# Altium project Genesys Hat.PrjPcb
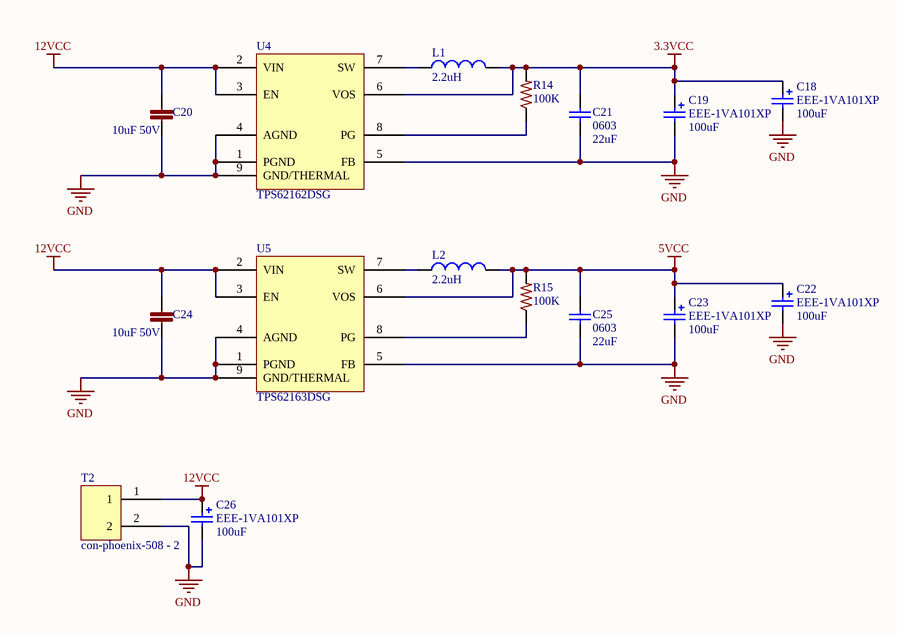
[diagram p0: Power.SchDoc]
6 sheets, 160 parts. Net scope: hierarchical (ports join the sheet entries above them; power ports are global).
Sheets:
  Power.SchDoc
  GenesysHat - System.SchDoc
    U_M = M.SchDoc
    U_MOSFETs = MOSFETs.SchDoc
    U_Sensors and IO = Sensors and IO.SchDoc
    U_MCU = MCU.SchDoc
    U_M = M.SchDoc

## Sheet Power.SchDoc
size A

### Parts
C18  EEE-1VA101XP  value 100uF  [EEE-1VA101XP]
C19  EEE-1VA101XP  value 100uF  [EEE-1VA101XP]
C20  10uF 50V  [C1206]
C21  0603  value 22uF  [C0805]
C22  EEE-1VA101XP  value 100uF  [EEE-1VA101XP]
C23  EEE-1VA101XP  value 100uF  [EEE-1VA101XP]
C24  10uF 50V  [C1206]
C25  0603  value 22uF  [C0805]
C26  EEE-1VA101XP  value 100uF  [EEE-1VA101XP]
L1  value 2.2uH  [VLS252012T-2R2M1R3]  (hidden comment: VLS252012T-2R2M1R3)
L2  value 2.2uH  [VLS252012T-2R2M1R3]  (hidden comment: VLS252012T-2R2M1R3)
R14  100K  [R0603]
R15  100K  [R0603]
T2  con-phoenix-508 - 2  [MSTBV2 - duplicate]
U4  TPS62162DSG  [DSG8-1600X900TP]
U5  TPS62163DSG  [DSG8-1600X900TP]

### Nets
3.3VCC: C18.1 C19.1 C21.2 L1.2 R14.2 U4.6(VOS)
5VCC: C22.1 C23.1 C25.2 L2.2 R15.2 U5.6(VOS)
12VCC: C20.1 C24.1 C26.1 T2.1 U4.2(VIN) U4.3(EN) U5.2(VIN) U5.3(EN)
GND: C18.2 C19.2 C20.2 C21.1 C22.2 C23.2 C24.2 C25.1 C26.2 T2.2 U4.1(PGND) U4.4(AGND) U4.5(FB) U4.9(GND/THERMAL) U5.1(PGND) U5.4(AGND) U5.5(FB) U5.9(GND/THERMAL)
NetL1_1: L1.1 U4.7(SW)
NetL2_1: L2.1 U5.7(SW)
NetR14_1: R14.1 U4.8(PG)
NetR15_1: R15.1 U5.8(PG)

### Library data of the parts
C18 C19 C22 C23 C26 = EEE-1VA101XP: CAP ALUM 100UF 35V 20% SMD; Manufacture: Panasonic; Digikey Part #: PCE3951CT-ND; Price: $0.63; Mount Type: SMT Panasonic VS D Series; Status: Active; Height: 7.70mm; Datasheet: http://industrial.panasonic.com/www-cgi/jvcr13pz.cgi?E+PZ+3+ABA0002+EEE1VA101XP+7+WW; Manufacture Part #: EEE-1VA101XP
C20 C24 = CL31A106KBHNNNE: CAP CER 10UF 50V 10% X5R 1206; Manufacturer: Samsung; LastRevisionNote: ImportComponents; Published: 25-mar-2015; Publisher: UltiMachine; LastRevisionDate: 25-mar-2015; ManufacturerPartNumber: CL31A106KBHNNNE; VALUE: 10uF 50V
C21 C25 = CL21A226KQQNNNE: CAP CER 22UF 6.3V 10% X5R 0805; MFR: Samsung; Voltage: 6.3VDC; Published: April 2015; LatestRevisionDate: April 2015; Component Type: Chip Capacitor; MFR Part #: CL21A226KQQNNNE; Part Description: CAP CER 22UF 6.3V 10% X5R 0805; Mounting Type: SMT 0805; Datasheet: http://www.digikey.com/product-detail/en/CL21A226KQQNNNE/1276-2907-2-ND/3888565; Height: 1mm; Tolerance: 10%; Digikey #: 1276-2907-2-ND; PackageReference: 0805
L1 L2 = VLS252012T-2R2M1R3: MFR: TDK Corporation; Published: April 2015; LatestRevisionDate: April 2015; LatestRevisionNote: IPC-7351 Footprint Added.; PackageReference: Custom Wound INductor; Publisher: Adam Vadala-Roth; PackageDescription: Wire Wound Inductor Package; MFR#: VLS252012T-2R2M1R3
R14 R15 = RC0603FR-07100KL: RES 100K OHM 1/10W 1% 0603 SMD; LastRevisionNote: ImportComponents; Published: 23-Apr-2014; Publisher: UltiMachine; LastRevisionDate: 23-Apr-2014; ManufacturerPartNumber: RC0603FR-07100KL; VALUE: 100K
T2 = con-phoenix-508_2
U4 U5 = TPS62162SOP

## Sheet GenesysHat - System.SchDoc
size A
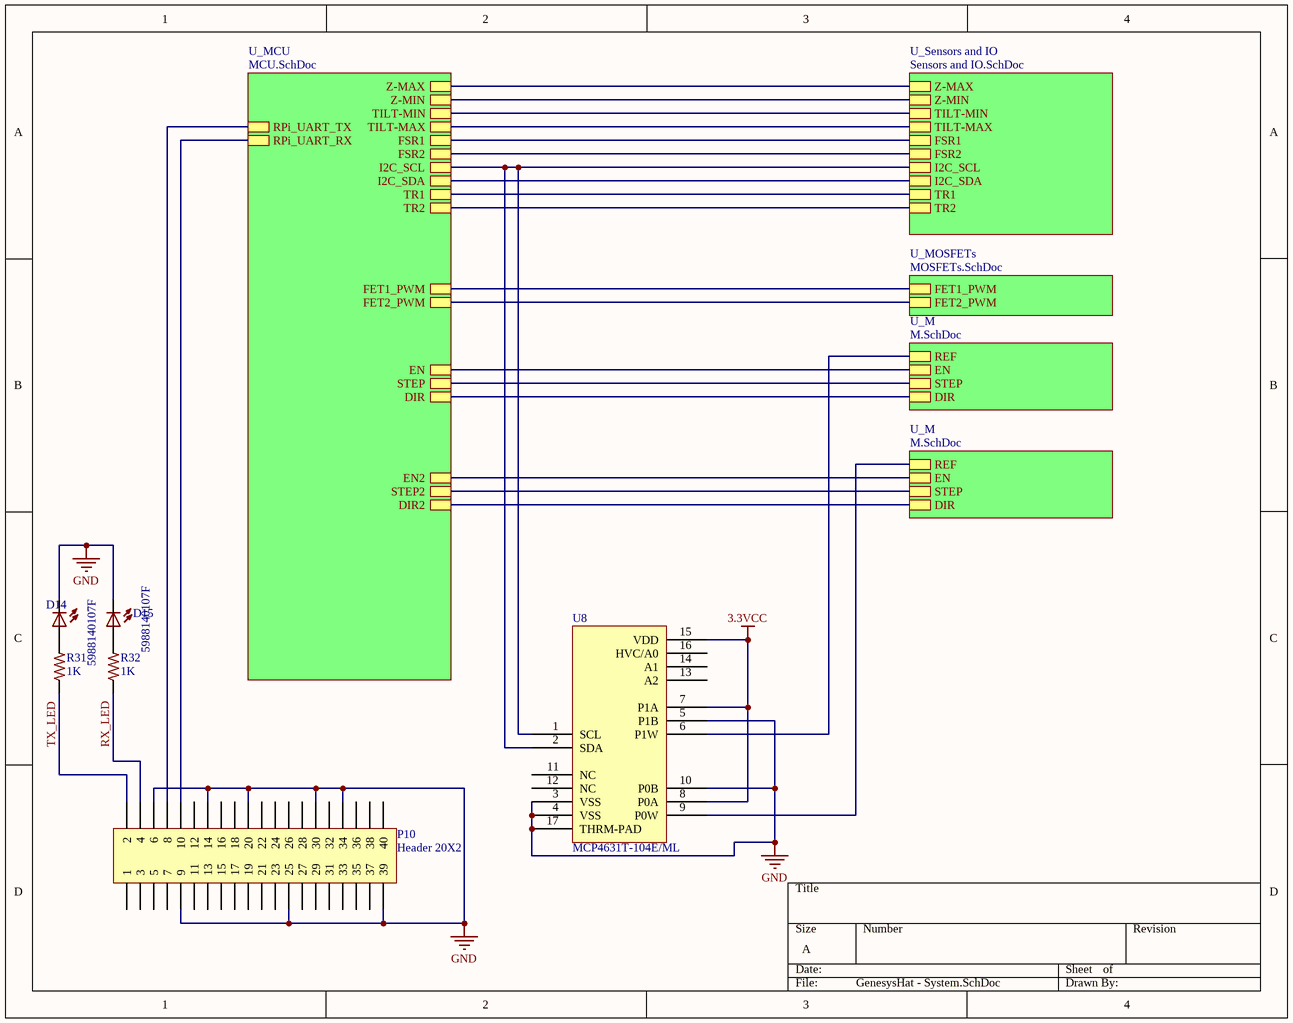
[diagram p1: GenesysHat - System.SchDoc]

### Parts
D14  5988140107F  [LED2012120]
D15  5988140107F  [LED2012120]
P10  Header 20X2  [HDR2X20]
R31  1K  [R0603]
R32  1K  [R0603]
U8  MCP4631T-104E/ML  [MCP4631T-104E/ML]

### Sub-sheets
U_M = M.SchDoc: REF, EN, STEP, DIR
U_M = M.SchDoc: REF, EN, STEP, DIR
U_MCU = MCU.SchDoc: FET1_PWM, FET2_PWM, Z-MAX, Z-MIN, TILT-MIN, TILT-MAX, FSR1, FSR2, I2C_SCL, I2C_SDA, TR1, TR2, EN, STEP, DIR, EN2, STEP2, DIR2, RPi_UART_TX, RPi_UART_RX
U_MOSFETs = MOSFETs.SchDoc: FET1_PWM, FET2_PWM
U_Sensors and IO = Sensors and IO.SchDoc: Z-MAX, Z-MIN, TILT-MIN, TILT-MAX, FSR1, FSR2, I2C_SCL, I2C_SDA, TR1, TR2

### Nets
3.3VCC: U8.7(P1A) U8.8(P0A) U8.15(VDD)
GND: D14.C D15.C P10.6 P10.9 P10.14 P10.20 P10.25 P10.30 P10.34 P10.39 U8.3(VSS) U8.4(VSS) U8.5(P1B) U8.10(P0B) U8.17(THRM-PAD)
RX_LED: P10.4 R32.1
TX_LED: P10.2 R31.1
NetC27_1: sheet U_Sensors and IO/TR1, sheet U_Sensors and IO/TR2, sheet U_MCU/TR1, sheet U_MCU/TR2
NetC30_2: sheet U_Sensors and IO/Z-MAX, sheet U_MCU/Z-MAX
NetC32_2: sheet U_Sensors and IO/Z-MIN, sheet U_MCU/Z-MIN
NetC33_2: sheet U_Sensors and IO/TILT-MIN, sheet U_MCU/TILT-MIN
NetC34_2: sheet U_Sensors and IO/TILT-MAX, sheet U_MCU/TILT-MAX
NetD14_A: D14.A R31.2
NetD15_A: D15.A R32.2
NetP10_8: P10.8 ; sheet U_MCU/RPi_UART_TX
NetP10_10: P10.10 ; sheet U_MCU/RPi_UART_RX
NetR3_U_M#1_1: U8.6(P1W) ; sheet U_M/REF
NetR3_U_M#2_1: U8.9(P0W) ; sheet U_M/REF
NetR22_2: sheet U_Sensors and IO/FSR2, sheet U_MCU/FSR2
NetR29_1: sheet U_Sensors and IO/FSR1, sheet U_MCU/FSR1
NetTP2_U_M#1_1: sheet U_M/EN, sheet U_MCU/EN
NetTP2_U_M#2_1: sheet U_MCU/EN2, sheet U_M/EN
NetTP11_U_M#1_1: sheet U_M/DIR, sheet U_MCU/DIR
NetTP11_U_M#2_1: sheet U_MCU/DIR2, sheet U_M/DIR
NetTP12_U_M#1_1: sheet U_M/STEP, sheet U_MCU/STEP
NetTP12_U_M#2_1: sheet U_MCU/STEP2, sheet U_M/STEP
NetU2_16: sheet U_MOSFETs/FET1_PWM, sheet U_MCU/FET1_PWM
NetU2_17: sheet U_MOSFETs/FET2_PWM, sheet U_MCU/FET2_PWM
NetU2_35: U8.1(SCL) U8.2(SDA) ; sheet U_Sensors and IO/I2C_SCL, sheet U_MCU/I2C_SCL
NetU2_36: sheet U_Sensors and IO/I2C_SDA, sheet U_MCU/I2C_SDA

Not connected (* = marked no-connect by the designer): P10 1 3 5 7 11 12 13 15 16 17 18 19 21 22 23 24 26 27 28 29 31 32 33 35 36 37 38 40; U8 11(NC) 12(NC) 13(A2) 14(A1) 16(HVC/A0)

### Library data of the parts
D14 D15 = 5988140107F: LED 0805 Yellow; LastRevisionNote: ImportComponents; Published: 23-Apr-2014; Publisher: UltiMachine; LastRevisionDate: 23-Apr-2014; VALUE: 5988140107F
P10 = Header 20X2: Header, 20-Pin, Dual row; LatestRevisionDate: 17-Jul-2002; LatestRevisionNote: Re-released for DXP Platform.; Publisher: Altium Limited
R31 R32 = ERJ-3EKF1001V: RES 0603 1K 100mW 1%; LastRevisionNote: ImportComponents; Published: 23-Apr-2014; Publisher: UltiMachine; LastRevisionDate: 23-Apr-2014; ManufacturerPartNumber: ERJ-3EKF1001V; VALUE: 1K
U8 = MCP4631T-104E/ML: IC DGTL POT 100K 129TAPS 16-QF; MFR: Microchip; MFR #: MCP4631T-104E/ML; Published Date: May 2015; Digikey #: MCP4631T-104E/MLCT-ND; Mounting Type: SMT QFN 16; Package: QFN 16

## Sheet M.SchDoc
size A
Used 2 times, as channels U_M, U_M. Parts and nets are listed once, with the designators drawn on the sheet.
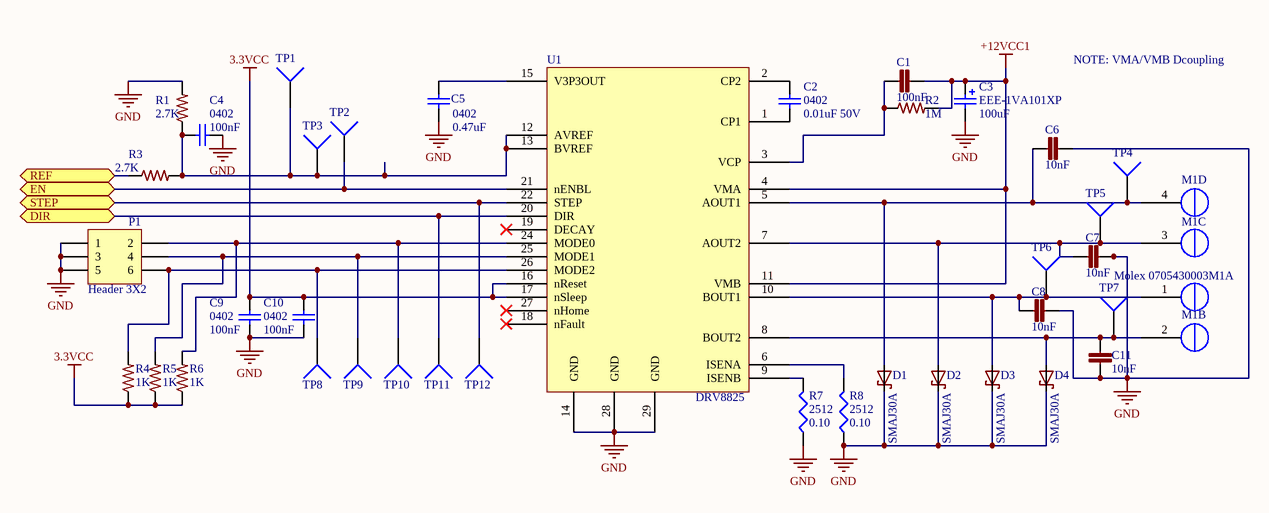
[diagram p2: M.SchDoc]

### Parts
C1  100nF  [C0603]
C2  value 0.01uF 50V  [C0402]  (hidden comment: 0402)
C3  EEE-1VA101XP  value 100uF  [EEE-1VA101XP]
C4  value 100nF  [C0402]  (hidden comment: 0402)
C5  value 0.47uF  [C0402]  (hidden comment: 0402)
C6  10nF  [C0603]
C7  10nF  [C0603]
C8  10nF  [C0603]
C9  value 100nF  [C0402]  (hidden comment: 0402)
C10  value 100nF  [C0402]  (hidden comment: 0402)
C11  10nF  [C0603]
D1  SMAJ30A  [SMA-SM]
D2  SMAJ30A  [SMA-SM]
D3  SMAJ30A  [SMA-SM]
D4  SMAJ30A  [SMA-SM]
M1  Molex 0705430003  [4POL254]  (parts A,B,C,D of 4)
P1  Header 3X2  [HDR2X3]
R1  2.7K  [R0402]
R2  1M  [R0402]
R3  2.7K  [R0402]
R4  1K  [R0603]
R5  1K  [R0603]
R6  1K  [R0603]
R7  2512  value 0.10  [2512R-0.55]
R8  2512  value 0.10  [2512R-0.55]
TP1  TP4  [TP-2]  (value not drawn)
TP2  TP4  [TP-2]  (value not drawn)
TP3  TP4  [TP-2]  (value not drawn)
TP4  TP4  [TP-2]  (value not drawn)
TP5  TP4  [TP-2]  (value not drawn)
TP6  TP4  [TP-2]  (value not drawn)
TP7  TP4  [TP-2]  (value not drawn)
TP8  TP4  [TP-2]  (value not drawn)
TP9  TP4  [TP-2]  (value not drawn)
TP10  TP4  [TP-2]  (value not drawn)
TP11  TP4  [TP-2]  (value not drawn)
TP12  TP4  [TP-2]  (value not drawn)
U1  DRV8825  [DRV8825]

### Ports
DIR, EN, REF, STEP

### Nets
3.3VCC: C9.2 C10.2 R4.1 R5.1 R6.1 U1.16(nReset) U1.17(nSleep)
+12VCC1: C1.2 C3.1 R2.2 U1.4(VMA) U1.11(VMB)
GND: C3.2 C4.1 C5.1 C6.2 C7.2 C8.2 C9.1 C10.1 C11.1 D1.C D2.C D3.C D4.C P1.1 P1.3 P1.5 R1.2 R7.1 R8.1 U1.14(GND) U1.28(GND) U1.29(GND)
DIR: TP11.1 U1.20(DIR) ; port DIR
EN: TP2.1 U1.21(nENBL) ; port EN
REF: R3.1 ; port REF
STEP: TP12.1 U1.22(STEP) ; port STEP
NetC1_1: C1.1 R2.1 U1.3(VCP)
NetC2_1: C2.1 U1.1(CP1)
NetC2_2: C2.2 U1.2(CP2)
NetC4_2: C4.2 R1.1 R3.2 TP1.1 TP3.1 U1.12(AVREF) U1.13(BVREF)
NetC5_2: C5.2 U1.15(V3P3OUT)
NetC6_1: C6.1 D1.A M1.4(OUT1B) TP4.1 U1.5(AOUT1)
NetC7_1: C7.1 D2.A M1.3(OUT1A) TP5.1 U1.7(AOUT2)
NetC8_1: C8.1 D3.A M1.1(OUT2B) TP6.1 U1.10(BOUT1)
NetC11_2: C11.2 D4.A M1.2(OUT2A) TP7.1 U1.8(BOUT2)
NetP1_2: P1.2 R6.2 TP10.1 U1.24(MODE0)
NetP1_4: P1.4 R5.2 TP9.1 U1.25(MODE1)
NetP1_6: P1.6 R4.2 TP8.1 U1.26(MODE2)
NetR7_2: R7.2 U1.9(ISENB)
NetR8_2: R8.2 U1.6(ISENA)

Not connected (* = marked no-connect by the designer): U1 18(nFault)* 19(DECAY)* 23(NC) 27(nHome)*

### Channels
U_M: designators end in _U_M#1; ports DIR=NetTP11_U_M#1_1 EN=NetTP2_U_M#1_1 REF=NetR3_U_M#1_1 STEP=NetTP12_U_M#1_1
U_M: designators end in _U_M#2; ports DIR=NetTP11_U_M#2_1 EN=NetTP2_U_M#2_1 REF=NetR3_U_M#2_1 STEP=NetTP12_U_M#2_1

### Notes on the sheet
- NOTE: VMA/VMB Dcoupling

### Library data of the parts
C1 = C0603C104K5RACTU: CAP CER 0603 100nF 50V 10% X7R; LastRevisionNote: ImportComponents; Published: 23-Apr-2014; Publisher: UltiMachine; LastRevisionDate: 23-Apr-2014; ManufacturerPartNumber: C0603C104K5RACTU; VALUE: 100nF
C2 = GRM155R71H103JA88D: CAP CER 10000PF 50V X7R 0402; MFR: Murata; Tolerance: 10%; Voltage: 6.3VDC; Published: 10 - Dec - 2014; LatestRevisionDate: 10 - Dec - 2014; LatestRevisionNote: Ultimachine Footprint Added; Publisher: Ultimachine; Component Type: Chip Capacitor; MFR Part #: GRM155R71H103JA88D; Part Description: CAP CER 10000PF 50V X7R 0402; Mounting Type: SMT 0402; Datasheet: http://search.murata.co.jp/Ceramy/image/img/A01X/G101/ENG/GRM155R71H103JA88-01.pdf; Height: 0.5 ±0.05mm; Digikey #: 490-7763-1-ND; PackageReference: 0402
C3 = EEE-1VA101XP: as C18 on sheet Power; Digikey Part #: PCE3951CT-ND; Price: $0.63; Mount Type: SMT Panasonic VS D Series; Status: Active; Height: 7.70mm; Datasheet: http://industrial.panasonic.com/www-cgi/jvcr13pz.cgi?E+PZ+3+ABA0002+EEE1VA101XP+7+WW; Manufacture Part #: EEE-1VA101XP
C4 C9 C10 = 100nF C0402 - GRM155R71C104KA88D: Capacitor (Semiconductor SIM Model); MFR: Murata; Part Description: CAP CER 0.1UF 16V 10% X7R 0402; Tolerance: 10%; Voltage: 16v; Published: 10 - Dec - 2014; LatestRevisionDate: 10 - Dec - 2014; LatestRevisionNote: Ultimachine Footprint Added; Publisher: Ultimachine; Component Type: Chip Capacitor; MFR Part #: GRM155R71C104KA88D; Mounting Type: SMT 0402; Datasheet: http://psearch.murata.com/capacitor/product/GRM155R71C104KA88%23.pdf; Height: 0.5 ±0.05mm; PackageReference: 0402
C5 = GRM155R60J474KE19D: 0.47uF 6.3v C0402 - GRM155R60J474KE19D; MFR: Murata; Part Description: CAP CER 0.47UF 6.3V 10% X5R 0402; Tolerance: 10%; Voltage: 6.3VDC; Published: 10 - Dec - 2014; LatestRevisionDate: 10 - Dec - 2014; LatestRevisionNote: Ultimachine Footprint Added; Publisher: Ultimachine; Component Type: Chip Capacitor; MFR Part #: GRM155R60J474KE19D; Mounting Type: SMT 0402; Datasheet: http://search.murata.co.jp/Ceramy/image/img/A01X/G101/ENG/GRM155R60J474KE19-01.pdf; Height: 0.5 ±0.05mm; PackageReference: 0402
C6-C8 C11 = C1608X7R1E103K080AA: CAP CER 0603 10nF 25V 10% X7R; LastRevisionNote: ImportComponents; Published: 23-Apr-2014; Publisher: UltiMachine; LastRevisionDate: 23-Apr-2014; ManufacturerPartNumber: C1608X7R1E103K080AA; VALUE: 10nF
D1-D4 = SMAJ30A: DIODE TVS 30V SMA; LastRevisionNote: ImportComponents; Published: 23-Apr-2014; Publisher: UltiMachine; LastRevisionDate: 23-Apr-2014; ManufacturerPartNumber: SMAJ30A
M1 = Molex 0705430003 Alt: Molex 4 Pin Clip Connector
P1 = Header 3X2: Header, 3-Pin, Dual row; LatestRevisionDate: 17-Jul-2002; LatestRevisionNote: Re-released for DXP Platform.; Publisher: Altium Limited
R1 R3 = ERJ-2RKF2701X: RES SMD 2.7K OHM 1% 1/10W 0402; Manufacturer: Panasonic; ManufacturerPartNumber: ERJ2GEJ105X; LastRevisionNote: ImportComponents; Published: 23-Apr-2014; Publisher: Adam; LastRevisionDate: 23-Apr-2014; VALUE: 2.7K
R2 = ERJ2GEJ105X: RES 0402 1M 100mW 5%; LastRevisionNote: ImportComponents; Published: 23-Apr-2014; Publisher: UltiMachine; LastRevisionDate: 23-Apr-2014; ManufacturerPartNumber: ERJ2GEJ105X; VALUE: 1M
R4-R6 = ERJ-3EKF1001V: as R31 on sheet GenesysHat - System; Published: 23-Apr-2014; Publisher: UltiMachine; LastRevisionDate: 23-Apr-2014; ManufacturerPartNumber: ERJ-3EKF1001V; VALUE: 1K
R7 R8 = CSRN2512FTR100: RES SMD 0.1 OHM 1% 2W 2512; MFR: Stackpole ELectronics Inc; PackageReference: 2512; MFR #: CSRN2512FTR100; Digikey #: CSRN2512FTR100TR-ND; PDF: http://www.seielect.com/catalog/SEI-CSR_CSRN.pdf
TP1-TP12 = Socket: LatestRevisionDate: 17-Jul-2002; LatestRevisionNote: Re-released for DXP Platform.; Publisher: Altium Limited
U1 = DRV8825: DRV8825 Ti Stepper Driver

## Sheet MOSFETs.SchDoc
size A
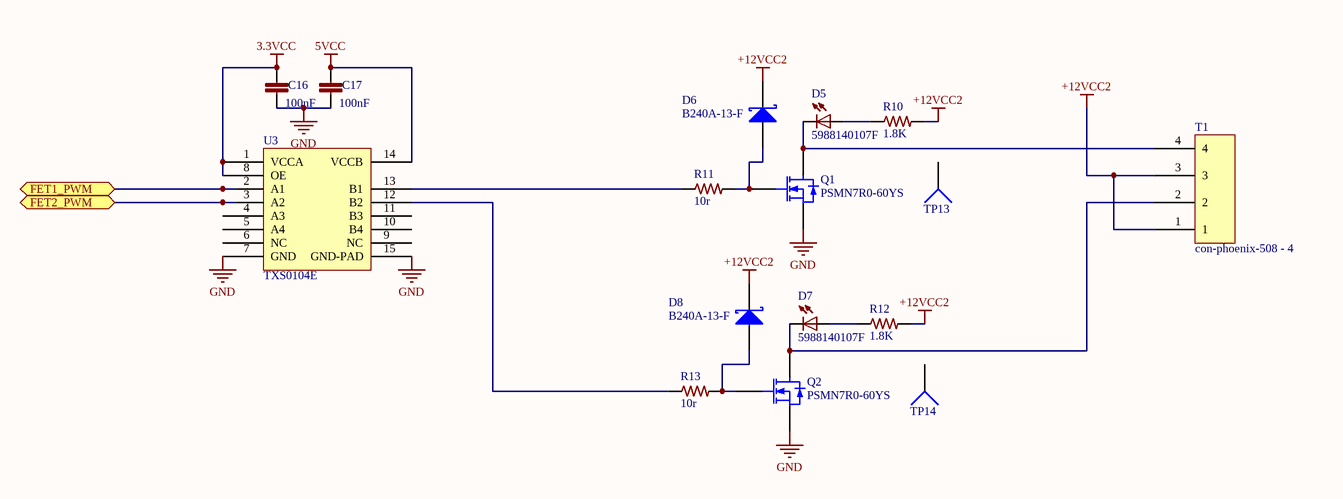
[diagram p3: MOSFETs.SchDoc]

### Parts
C16  100nF  [C0402]
C17  100nF  [C0402]
D5  5988140107F  [LED2012120]
D6  B240A-13-F  [SK310A-TP]
D7  5988140107F  [LED2012120]
D8  B240A-13-F  [SK310A-TP]
Q1  PSMN7R0-60YS  [PSMN7R0-60YS]
Q2  PSMN7R0-60YS  [PSMN7R0-60YS]
R10  1.8K  [R0603]
R11  10r  [R0603]
R12  1.8K  [R0603]
R13  10r  [R0603]
T1  con-phoenix-508 - 4  [MSTBV4]
TP13  TP4  [TP-2]  (value not drawn)
TP14  TP4  [TP-2]  (value not drawn)
U3  TXS0104E  [RGY  (S-PVQFN-N14)]

### Ports
FET1_PWM, FET2_PWM

### Nets
3.3VCC: C16.1 U3.1(VCCA) U3.8(OE)
5VCC: C17.1 U3.14(VCCB)
+12VCC2: D6.2(K) D8.2(K) R10.2 R12.2 T1.1 T1.3
GND: C16.2 C17.2 Q1.1(S) Q1.2(S) Q1.3(S) Q2.1(S) Q2.2(S) Q2.3(S) U3.7(GND) U3.15(GND-PAD)
NetD5_A: D5.A R10.1
NetD5_C: D5.C Q1.5(D) T1.4
NetD6_1: D6.1(A) Q1.4(G) R11.2
NetD7_A: D7.A R12.1
NetD7_C: D7.C Q2.5(D) T1.2
NetD8_1: D8.1(A) Q2.4(G) R13.2
NetR11_1: R11.1 U3.13(B1)
NetR13_1: R13.1 U3.12(B2)
NetU2_16: U3.2(A1) ; port FET1_PWM
NetU2_17: U3.3(A2) ; port FET2_PWM

Not connected (* = marked no-connect by the designer): TP13 1; TP14 1; U3 4(A3) 5(A4) 6(NC) 9(NC) 10(B4) 11(B3)

### Library data of the parts
C16 C17 = GRM155R71C104KA88D: CAP CER 0402 100nF 16V 10% X7R; LastRevisionNote: ImportComponents; Published: 23-Apr-2014; Publisher: UltiMachine; LastRevisionDate: 23-Apr-2014; ManufacturerPartNumber: GRM155R71C104KA88D; VALUE: 100nF
D5 D7 = 5988140107F: as D14 on sheet GenesysHat - System; Published: 23-Apr-2014; Publisher: UltiMachine; LastRevisionDate: 23-Apr-2014; VALUE: 5988140107F
D6 D8 = D Schottky: Schottky Diode; Published: 8-Jun-2000; LatestRevisionDate: 17-Jul-2002; LatestRevisionNote: Re-released for DXP Platform.; PackageReference: SMB; Publisher: Altium Limited; PackageDescription: DO-214-AA/SMB; 2 C-Bend Leads; Body 5.3 x 3.6 mm, inc. leads (LxW); Code_JEDEC: DO-214-AA
Q1 Q2 = PSMN7R0-60YS: N-Channel MOSFET; Published: 8-Jun-2000; LatestRevisionDate: 17-Jul-2002; LatestRevisionNote: Re-released for DXP Platform.; PackageVersion: 1995/1996; PackageReference: E3; Publisher: Altium Limited; PackageDescription: TO, Flat Index; 3 In-Line, Axial Leads; Body Dia. 4.6mm; Lead Dia. 0.5 mm (max)
R10 R12 = RC0603JR-071K8L: RES 0603 1.8K 100mW 5%; LastRevisionNote: ImportComponents; Published: 23-Apr-2014; Publisher: UltiMachine; LastRevisionDate: 23-Apr-2014; ManufacturerPartNumber: RC0603JR-071K8L; VALUE: 1.8K
R11 R13 = CRCW060310R0FKEA: RES 0603 10r 100mW 1%; LastRevisionNote: ImportComponents; Published: 23-Apr-2014; Publisher: UltiMachine; LastRevisionDate: 23-Apr-2014; ManufacturerPartNumber: CRCW060310R0FKEA; VALUE: 10r
T1 = con-phoenix-508_4
TP13 TP14 = Socket: LatestRevisionDate: 17-Jul-2002; LatestRevisionNote: Re-released for DXP Platform.; Publisher: Altium Limited
U3 = TXS0104E: TXS0104E - Bidriectional Opendrain/pushpull level shift; MFR: Texas Instruments; MFR Part #: TXS0104ERGYR; Active: Yes; Digikey Part #: 296-20698-2-ND; Height: 1mm; mounting Type: SMD; Datasheet: http://www.ti.com/lit/ds/symlink/txs0104e.pdf; Lead Free ?: RhoS

## Sheet Sensors and IO.SchDoc
size A
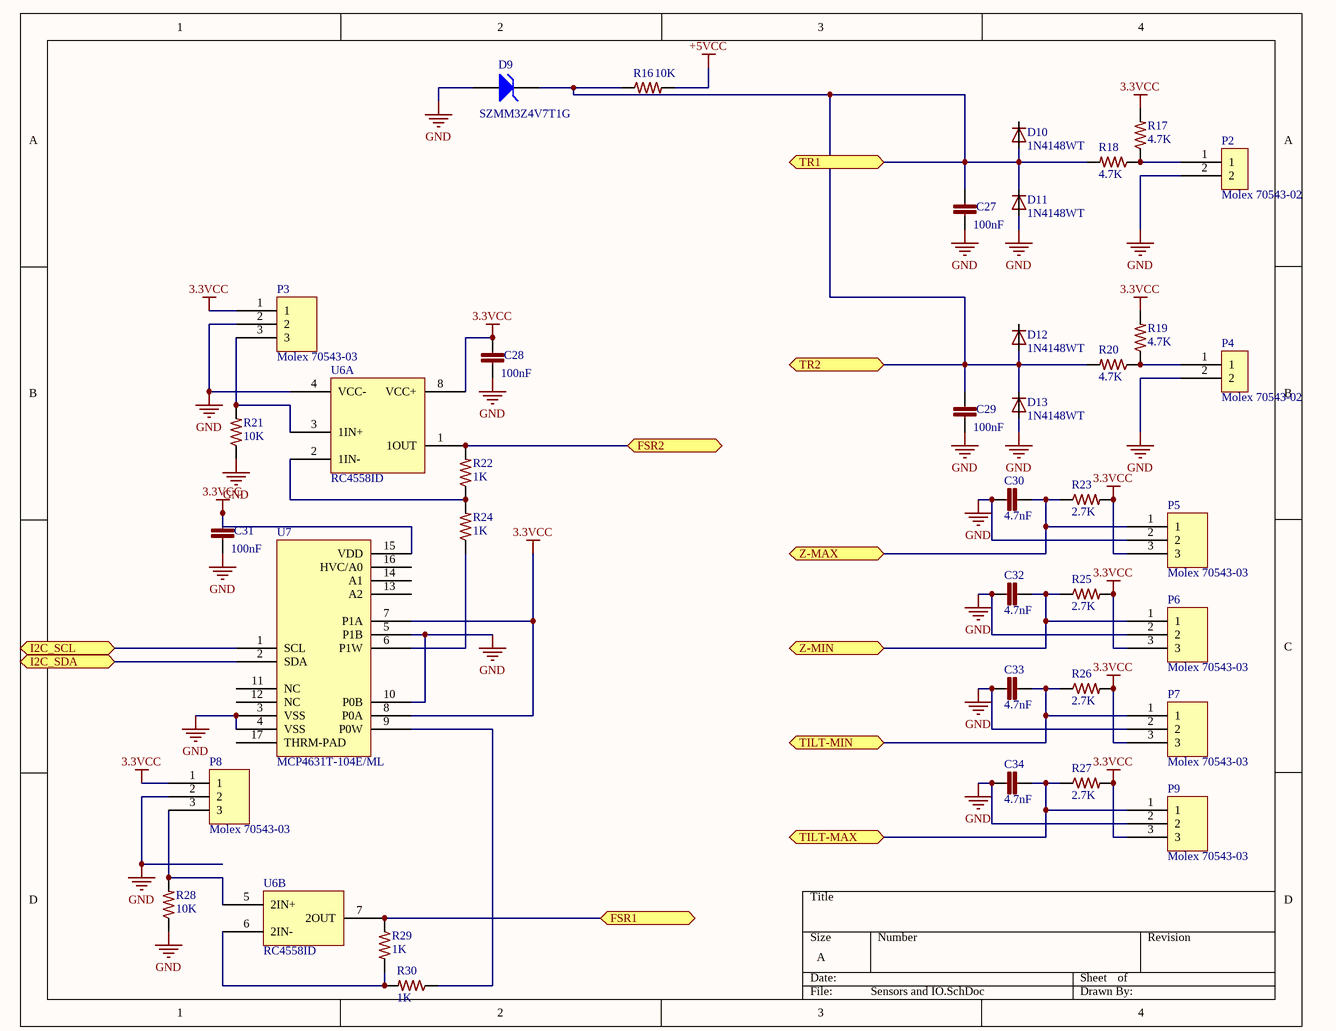
[diagram p4: Sensors and IO.SchDoc]

### Parts
C27  100nF  [C0402]
C28  100nF  [C0402]
C29  100nF  [C0402]
C30  4.7nF  [C0402]
C31  100nF  [C0402]
C32  4.7nF  [C0402]
C33  4.7nF  [C0402]
C34  4.7nF  [C0402]
D9  SZMM3Z4V7T1G  [SZMM3Z4V7T1G]
D10  1N4148WT  [SOD523]
D11  1N4148WT  [SOD523]
D12  1N4148WT  [SOD523]
D13  1N4148WT  [SOD523]
P2  Molex 70543-02  [70543-02]
P3  Molex 70543-03  [70543-03]
P4  Molex 70543-02  [70543-02]
P5  Molex 70543-03  [70543-03]
P6  Molex 70543-03  [70543-03]
P7  Molex 70543-03  [70543-03]
P8  Molex 70543-03  [70543-03]
P9  Molex 70543-03  [70543-03]
R16  10K  [R0603]
R17  4.7K  [R0603]
R18  4.7K  [R0603]
R19  4.7K  [R0603]
R20  4.7K  [R0603]
R21  10K  [R0603]
R22  1K  [R0603]
R23  2.7K  [R0402]
R24  1K  [R0603]
R25  2.7K  [R0402]
R26  2.7K  [R0402]
R27  2.7K  [R0402]
R28  10K  [R0603]
R29  1K  [R0603]
R30  1K  [R0603]
U6  RC4558ID  [TSOP65P490X110-8N]  (parts A,B of 2)
U7  MCP4631T-104E/ML  [MCP4631T-104E/ML]

### Ports
FSR1, FSR2, I2C_SCL, I2C_SDA, TILT-MAX, TILT-MIN, TR1, TR2, Z-MAX, Z-MIN

### Nets
3.3VCC: C28.1 C31.1 P3.1 P5.3 P6.3 P7.3 P8.1 P9.3 R17.2 R19.2 R23.2 R25.2 R26.2 R27.2 U6.8(VCC+) U7.7(P1A) U7.8(P0A) U7.15(VDD)
+5VCC: R16.2
GND: C27.2 C28.2 C29.2 C30.1 C31.2 C32.1 C33.1 C34.1 D9.1(A) D11.A D13.A P2.2 P3.2 P4.2 P5.2 P6.2 P7.2 P8.2 P9.2 R21.1 R28.1 U6.4(VCC-) U7.3(VSS) U7.4(VSS) U7.5(P1B) U7.10(P0B)
NetC27_1: C27.1 C29.1 D9.2(K) D10.A D11.C D12.A D13.C R16.1 R18.2 R20.2 ; port TR1, port TR2
NetC30_2: C30.2 P5.1 R23.1 ; port Z-MAX
NetC32_2: C32.2 P6.1 R25.1 ; port Z-MIN
NetC33_2: C33.2 P7.1 R26.1 ; port TILT-MIN
NetC34_2: C34.2 P9.1 R27.1 ; port TILT-MAX
NetP2_1: P2.1 R17.1 R18.1
NetP3_3: P3.3 R21.2 U6.3(1IN+)
NetP4_1: P4.1 R19.1 R20.1
NetP8_3: P8.3 R28.2 U6.5(2IN+)
NetR22_1: R22.1 R24.2 U6.2(1IN-)
NetR22_2: R22.2 U6.1(1OUT) ; port FSR2
NetR24_1: R24.1 U7.6(P1W)
NetR29_1: R29.1 U6.7(2OUT) ; port FSR1
NetR29_2: R29.2 R30.2 U6.6(2IN-)
NetR30_1: R30.1 U7.9(P0W)
NetU2_35: U7.1(SCL) ; port I2C_SCL
NetU2_36: U7.2(SDA) ; port I2C_SDA

Not connected (* = marked no-connect by the designer): D10 C; D12 C; U7 11(NC) 12(NC) 13(A2) 14(A1) 16(HVC/A0) 17(THRM-PAD)

### Library data of the parts
C27-C29 C31 = GRM155R71C104KA88D: as C16 on sheet MOSFETs; Published: 23-Apr-2014; Publisher: UltiMachine; LastRevisionDate: 23-Apr-2014; ManufacturerPartNumber: GRM155R71C104KA88D; VALUE: 100nF
C30 C32-C34 = CC0402KRX7R8BB472: CAP CER 0402 4.7nF 25V 10% X7R; LastRevisionNote: ImportComponents; Published: 23-Apr-2014; Publisher: UltiMachine; LastRevisionDate: 23-Apr-2014; ManufacturerPartNumber: CC0402KRX7R8BB472; VALUE: 4.7nF
D9 = D Zener: Zener Diode; Published: 8-Jun-2000; LatestRevisionDate: 17-Jul-2002; LatestRevisionNote: Re-released for DXP Platform.; PackageReference: DIODE-0.7; Publisher: Altium Limited; PackageDescription: Diode, Thru-Hole; 2 Leads; 0.7 in Pin Spacing
D10-D13 = 1N4148WT: DIODE SOD523; LastRevisionNote: ImportComponents; Published: 23-Apr-2014; Publisher: UltiMachine; LastRevisionDate: 23-Apr-2014; Value: 1N4148WT
P3 P5-P9 = Molex Endstop
R16 R21 R28 = ERJ-3EKF1002V: RES 0603 10K 100mW 1%; LastRevisionNote: ImportComponents; Published: 23-Apr-2014; Publisher: UltiMachine; LastRevisionDate: 23-Apr-2014; ManufacturerPartNumber: ERJ-3EKF1002V; VALUE: 10K
R17-R20 = ERJ3EKF4701V: RES 0603 4.7K 100mW 1%; LastRevisionNote: ImportComponents; Published: 23-Apr-2014; Publisher: UltiMachine; LastRevisionDate: 23-Apr-2014; ManufacturerPartNumber: ERJ3EKF4701V; VALUE: 4.7K
R22 R24 R29 R30 = ERJ-3EKF1001V: as R31 on sheet GenesysHat - System; Published: 23-Apr-2014; Publisher: UltiMachine; LastRevisionDate: 23-Apr-2014; ManufacturerPartNumber: ERJ-3EKF1001V; VALUE: 1K
R23 R25-R27 = ERJ-2GEJ272X: RES SMD 2.7K OHM 5% 1/10W 0402; LastRevisionNote: ImportComponents; Published: 23-Apr-2014; Publisher: Adam Vadala-Roth; LastRevisionDate: 23-Apr-2014; ManufacturerPartNumber: ERJ-2GEJ272X; Digikey #: P2.7KJCT-ND; Tolerance: 5%; Mounting type: SMD; VALUE: 2.7K
U6 = RC4558ID: MFR: Ti; MFR #: RC4558ID
U7 = MCP4631T-104E/ML: as U8 on sheet GenesysHat - System; MFR #: MCP4631T-104E/ML; Published Date: May 2015; Digikey #: MCP4631T-104E/MLCT-ND; Mounting Type: SMT QFN 16; Package: QFN 16

## Sheet MCU.SchDoc
size A
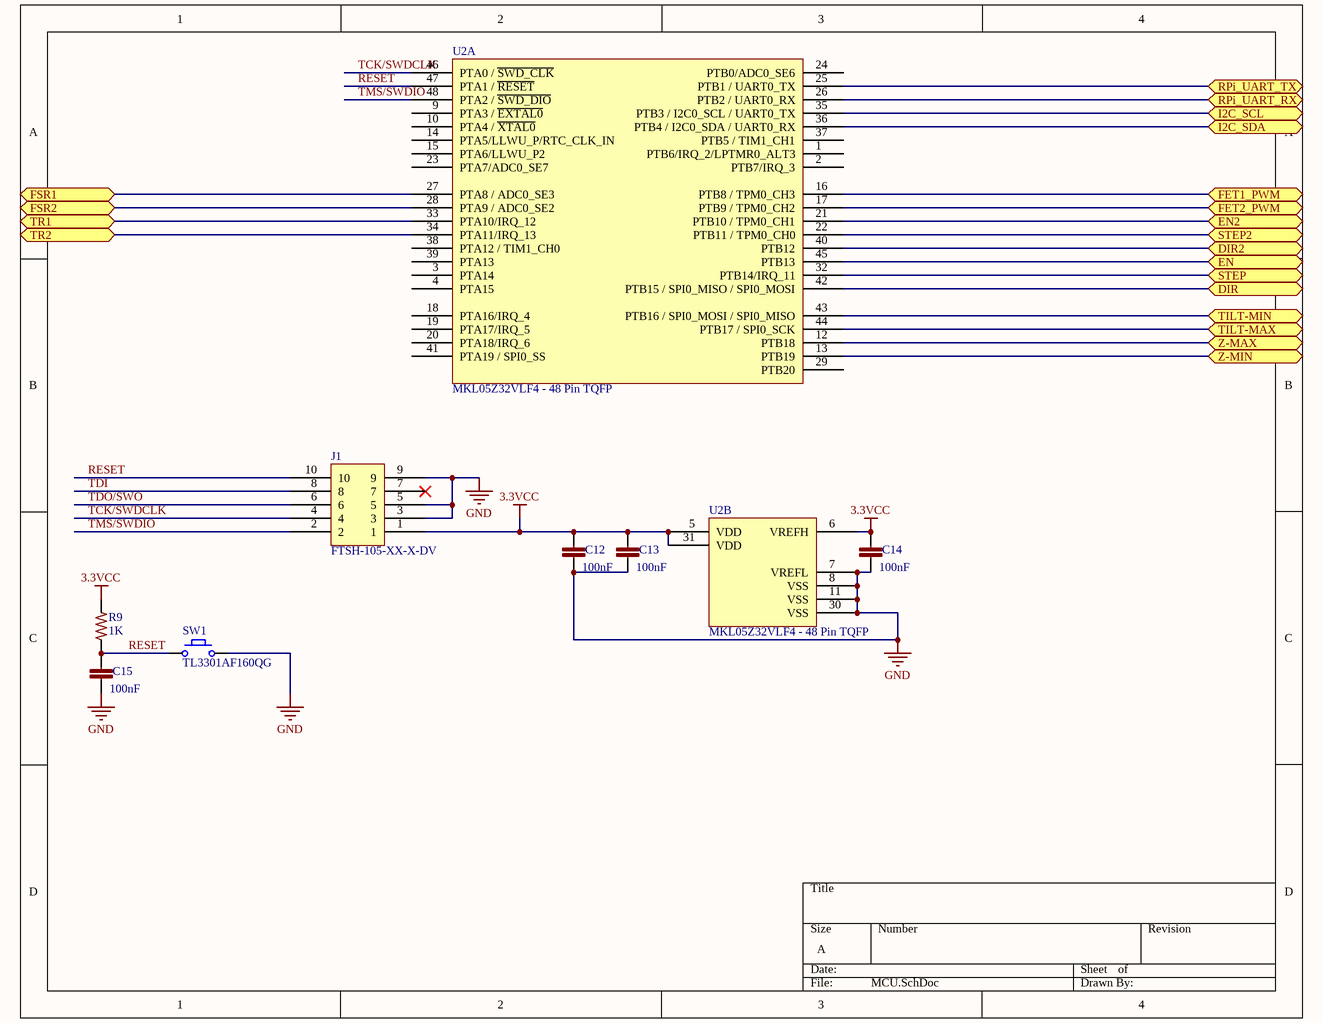
[diagram p5: MCU.SchDoc]

### Parts
C12  100nF  [C0402]
C13  100nF  [C0402]
C14  100nF  [C0402]
C15  100nF  [C0402]
J1  FTSH-105-XX-X-DV  [FTSH-105-XX-X-DV]
R9  1K  [R0603]
SW1  TL3301AF160QG  [TL3301AF160QG]
U2  MKL05Z32VLF4 - 48 Pin TQFP  (parts A,B of 2)

### Ports
DIR, DIR2, EN, EN2, FET1_PWM, FET2_PWM, FSR1, FSR2, I2C_SCL, I2C_SDA, RPi_UART_RX, RPi_UART_TX, STEP, STEP2, TILT-MAX, TILT-MIN, TR1, TR2, Z-MAX, Z-MIN

### Nets
3.3VCC: C12.1 C13.1 C14.1 J1.1 R9.2 U2.5(VDD) U2.6(VREFH) U2.31(VDD)
GND: C12.2 C13.2 C14.2 C15.2 J1.3 J1.5 J1.9 SW1.2 U2.7(VREFL) U2.8(VSS) U2.11(VSS) U2.30(VSS)
RESET: C15.1 J1.10 R9.1 SW1.1 U2.47(PTA1_/_~{RESET})
TCK/SWDCLK: J1.4 U2.46(PTA0_/_~{SWD_CLK})
TDI: J1.8
TDO/SWO: J1.6
TMS/SWDIO: J1.2 U2.48(PTA2_/_~{SWD_DIO})
NetC27_1: U2.33(PTA10/IRQ_12) U2.34(PTA11/IRQ_13) ; port TR1, port TR2
NetC30_2: U2.12(PTB18) ; port Z-MAX
NetC32_2: U2.13(PTB19) ; port Z-MIN
NetC33_2: U2.43(PTB16_/_SPI0_MOSI_/_SPI0_MISO) ; port TILT-MIN
NetC34_2: U2.44(PTB17_/_SPI0_SCK) ; port TILT-MAX
NetP10_8: U2.25(PTB1_/_UART0_TX) ; port RPi_UART_TX
NetP10_10: U2.26(PTB2_/_UART0_RX) ; port RPi_UART_RX
NetR22_2: U2.28(PTA9_/_ADC0_SE2) ; port FSR2
NetR29_1: U2.27(PTA8_/_ADC0_SE3) ; port FSR1
NetTP2_U_M#1_1: U2.45(PTB13) ; port EN
NetTP2_U_M#2_1: U2.21(PTB10_/_TPM0_CH1) ; port EN2
NetTP11_U_M#1_1: U2.42(PTB15_/_SPI0_MISO_/_SPI0_MOSI) ; port DIR
NetTP11_U_M#2_1: U2.40(PTB12) ; port DIR2
NetTP12_U_M#1_1: U2.32(PTB14/IRQ_11) ; port STEP
NetTP12_U_M#2_1: U2.22(PTB11_/_TPM0_CH0) ; port STEP2
NetU2_16: U2.16(PTB8_/_TPM0_CH3) ; port FET1_PWM
NetU2_17: U2.17(PTB9_/_TPM0_CH2) ; port FET2_PWM
NetU2_35: U2.35(PTB3_/_I2C0_SCL_/_UART0_TX) ; port I2C_SCL
NetU2_36: U2.36(PTB4_/_I2C0_SDA_/_UART0_RX) ; port I2C_SDA

Not connected (* = marked no-connect by the designer): J1 7*; U2 1(PTB6/IRQ_2/LPTMR0_ALT3) 2(PTB7/IRQ_3) 3(PTA14) 4(PTA15) 9(PTA3_/_~{EXTAL0}) 10(PTA4_/_~{XTAL0}) 14(PTA5/LLWU_P/RTC_CLK_IN) 15(PTA6/LLWU_P2) 18(PTA16/IRQ_4) 19(PTA17/IRQ_5) 20(PTA18/IRQ_6) 23(PTA7/ADC0_SE7) 24(PTB0/ADC0_SE6) 29(PTB20) 37(PTB5_/_TIM1_CH1) 38(PTA12_/_TIM1_CH0) 39(PTA13) 41(PTA19_/_SPI0_SS)

### Library data of the parts
C12-C15 = GRM155R71C104KA88D: as C16 on sheet MOSFETs; Published: 23-Apr-2014; Publisher: UltiMachine; LastRevisionDate: 23-Apr-2014; ManufacturerPartNumber: GRM155R71C104KA88D; VALUE: 100nF
J1 = ARM Cortex JTAG-DEBUG Header
R9 = ERJ-3EKF1001V: as R31 on sheet GenesysHat - System; Published: 23-Apr-2014; Publisher: UltiMachine; LastRevisionDate: 23-Apr-2014; ManufacturerPartNumber: ERJ-3EKF1001V; VALUE: 1K
U2 = MKL05Z32VLF4 - 48 Pin TQFP: ARM Cortex M0+
SW1 = TL3301AF160QG: MFR: *; MFR#: TL3301AF160QG; Type: SMD Momentary Tactile Switch; Height: *

## Nets that join several sheets
3.3VCC: Power (6 pins), GenesysHat - System (U8.7 U8.8 U8.15), U_M (7 pins), MOSFETs (C16.1 U3.1 U3.8), Sensors and IO (18 pins), MCU (8 pins), U_M (7 pins)
5VCC: Power (6 pins), MOSFETs (C17.1 U3.14)
+12VCC1: U_M (5 pins), U_M (5 pins)
GND: Power (18 pins), GenesysHat - System (15 pins), U_M (22 pins), MOSFETs (10 pins), Sensors and IO (26 pins), MCU (12 pins), U_M (22 pins)
NetC27_1: Sensors and IO (10 pins), MCU (U2.33 U2.34)
NetC30_2: Sensors and IO (C30.2 P5.1 R23.1), MCU (U2.12)
NetC32_2: Sensors and IO (C32.2 P6.1 R25.1), MCU (U2.13)
NetC33_2: Sensors and IO (C33.2 P7.1 R26.1), MCU (U2.43)
NetC34_2: Sensors and IO (C34.2 P9.1 R27.1), MCU (U2.44)
NetP10_8: GenesysHat - System (P10.8), MCU (U2.25)
NetP10_10: GenesysHat - System (P10.10), MCU (U2.26)
NetR3_U_M#1_1: GenesysHat - System (U8.6), U_M (R3_U_M#1.1)
NetR3_U_M#2_1: GenesysHat - System (U8.9), U_M (R3_U_M#2.1)
NetR22_2: Sensors and IO (R22.2 U6.1), MCU (U2.28)
NetR29_1: Sensors and IO (R29.1 U6.7), MCU (U2.27)
NetTP2_U_M#1_1: U_M (TP2_U_M#1.1 U1_U_M#1.21), MCU (U2.45)
NetTP2_U_M#2_1: MCU (U2.21), U_M (TP2_U_M#2.1 U1_U_M#2.21)
NetTP11_U_M#1_1: U_M (TP11_U_M#1.1 U1_U_M#1.20), MCU (U2.42)
NetTP11_U_M#2_1: MCU (U2.40), U_M (TP11_U_M#2.1 U1_U_M#2.20)
NetTP12_U_M#1_1: U_M (TP12_U_M#1.1 U1_U_M#1.22), MCU (U2.32)
NetTP12_U_M#2_1: MCU (U2.22), U_M (TP12_U_M#2.1 U1_U_M#2.22)
NetU2_16: MOSFETs (U3.2), MCU (U2.16)
NetU2_17: MOSFETs (U3.3), MCU (U2.17)
NetU2_35: GenesysHat - System (U8.1 U8.2), Sensors and IO (U7.1), MCU (U2.35)
NetU2_36: Sensors and IO (U7.2), MCU (U2.36)